# EAGLE design POWER-DCDC (EAGLE 9.4.0)
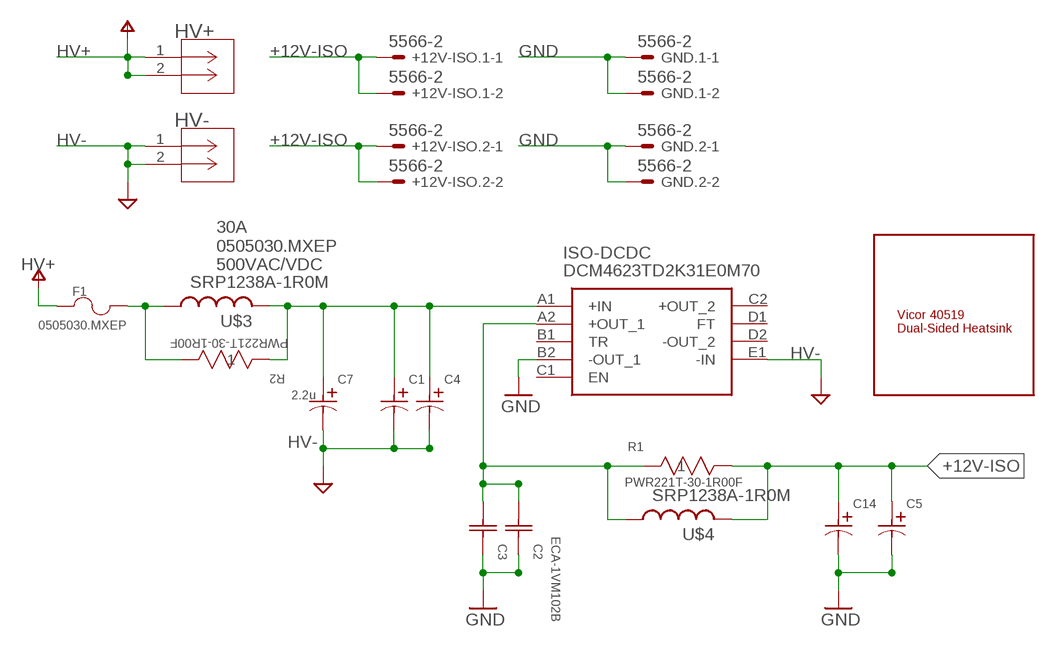
[diagram p0: schematic, sheet 1]

## Parts
+12V-ISO.1  5566-2  [5566-2]
+12V-ISO.2  5566-2  [5566-2]
C1  ECA-2WHG2R2  [PCAP_10X125]
C2  ECA-1VM102B  [CAP_PAN_12.5X20]
C3  ECA-1VM102B  [CAP_PAN_12.5X20]
C4  ECA-2WHG2R2  [PCAP_10X125]
C5  ECA-2WHG2R2  [PCAP_10X125]
C7  2.2u  ECA-2WHG2R2  [PCAP_10X125]
C14  ECA-2WHG2R2  [PCAP_10X125]
F1  0505030.MXEP  [0505030.MXEP]
GND.1  5566-2  [5566-2]
GND.2  5566-2  [5566-2]
HEATSINK  DCMHEATSINK  [DCMHEATSINK]
HV+  2P_1-770166-0  [CON2_1X2_P163_VMNL-1MTG]
HV-  2P_1-770166-0  [CON2_1X2_P163_VMNL-1MTG]
ISO-DCDC  DCM4623TD2K31E0M70  [DCM4623TD2N17C8T70]
R1  PWR221T-30-1R00F  [BO_PWR221T]
R2  PWR221T-30-1R00F  [BO_PWR221T]
U$3  SRP1238A-1R0M  [SRP1238A-R22M]
U$4  SRP1238A-1R0M  [SRP1238A-R22M]

## Nets
+12V-ISO: +12V-ISO.1.1 +12V-ISO.1.2 +12V-ISO.2.1 +12V-ISO.2.2 C5.1 C14.1 R1.2 U$4.2
+12V-OUT: C2.1 C3.1 ISO-DCDC.A2(+OUT_1) R1.1 U$4.1
GND: C2.2 C3.2 C5.2 C14.2 GND.1.1 GND.1.2 GND.2.1 GND.2.2 ISO-DCDC.B2(-OUT_1)
HV+: F1.1 HV+.1 HV+.2 ; supply symbol labelled V+
HV+_POSTFUSE: F1.2 R2.2 U$3.1
HV-: C1.2 C4.2 C7.2 HV-.1 HV-.2 ISO-DCDC.E1(-IN) ; supply symbol labelled AGND
N$1: C1.1 C4.1 C7.1 ISO-DCDC.A1(+IN) R2.1 U$3.2
Unconnected: ISO-DCDC.B1(TR) ISO-DCDC.C1(EN) ISO-DCDC.C2(+OUT_2) ISO-DCDC.D1(FT) ISO-DCDC.D2(-OUT_2)

## Notes on the sheet
- 30A
  0505030.MXEP
  500VAC/VDC

## Library data of the parts
+12V-ISO.1 +12V-ISO.2 GND.1 GND.2 = con-molex:5566-2: Mini FIT connector 2 pol Source: http://www.molex.com; MF: MOLEX; OC_FARNELL: 1822072; OC_NEWARK: unknown
C1 C4 C5 C7 C14 = IowaFormula:ECA-2WHG2R2; MANUFACTURER_PART_NUMBER: ECA2WHG2R2; VENDOR: Panasonic
C2 C3 = IowaFormula:ECA-1VM102B; MANUFACTURER_PART_NUMBER: ECA1VM102B; VENDOR: Panasonic
F1 = IowaFormula:0505030.MXEP
HEATSINK = IowaFormula:DCMHEATSINK
HV+ HV- = con-MATE-N-LOK:2P_1-770166-0; MANUFACTURER_PART_NUMBER: 17701660; VENDOR: TE Connectivity
ISO-DCDC = DCM4623:DCM4623TD2K31E0M70: Isolated DC/DC Converters 500W 270Vin 28Vout 4623 Package Source: Datasheet <https://componentsearchengine.com/Datasheets/1/DCM4623TD2K31E0M70.pdf>; DESCRIPTION: Isolated DC/DC Converters 500W 270Vin 28Vout 4623 Package; HEIGHT: 5mm; MANUFACTURER_NAME: VICOR; MANUFACTURER_PART_NUMBER: DCM4623TD2K31E0M70; MOUSER_PART_NUMBER: 492-DCM4623D2K31E0M7; MOUSER_PRICE-STOCK: https://www.mouser.com/Search/Refine.aspx?Keyword=492-DCM4623D2K31E0M7
R1 R2 = IowaFormula:PWR221T-30-1R00F; MANUFACTURER_PART_NUMBER: PWR221T301R00F; VENDOR: Bourns Electronics
U$3 U$4 = IowaFormula:SRP1238A-1R0M

## Board
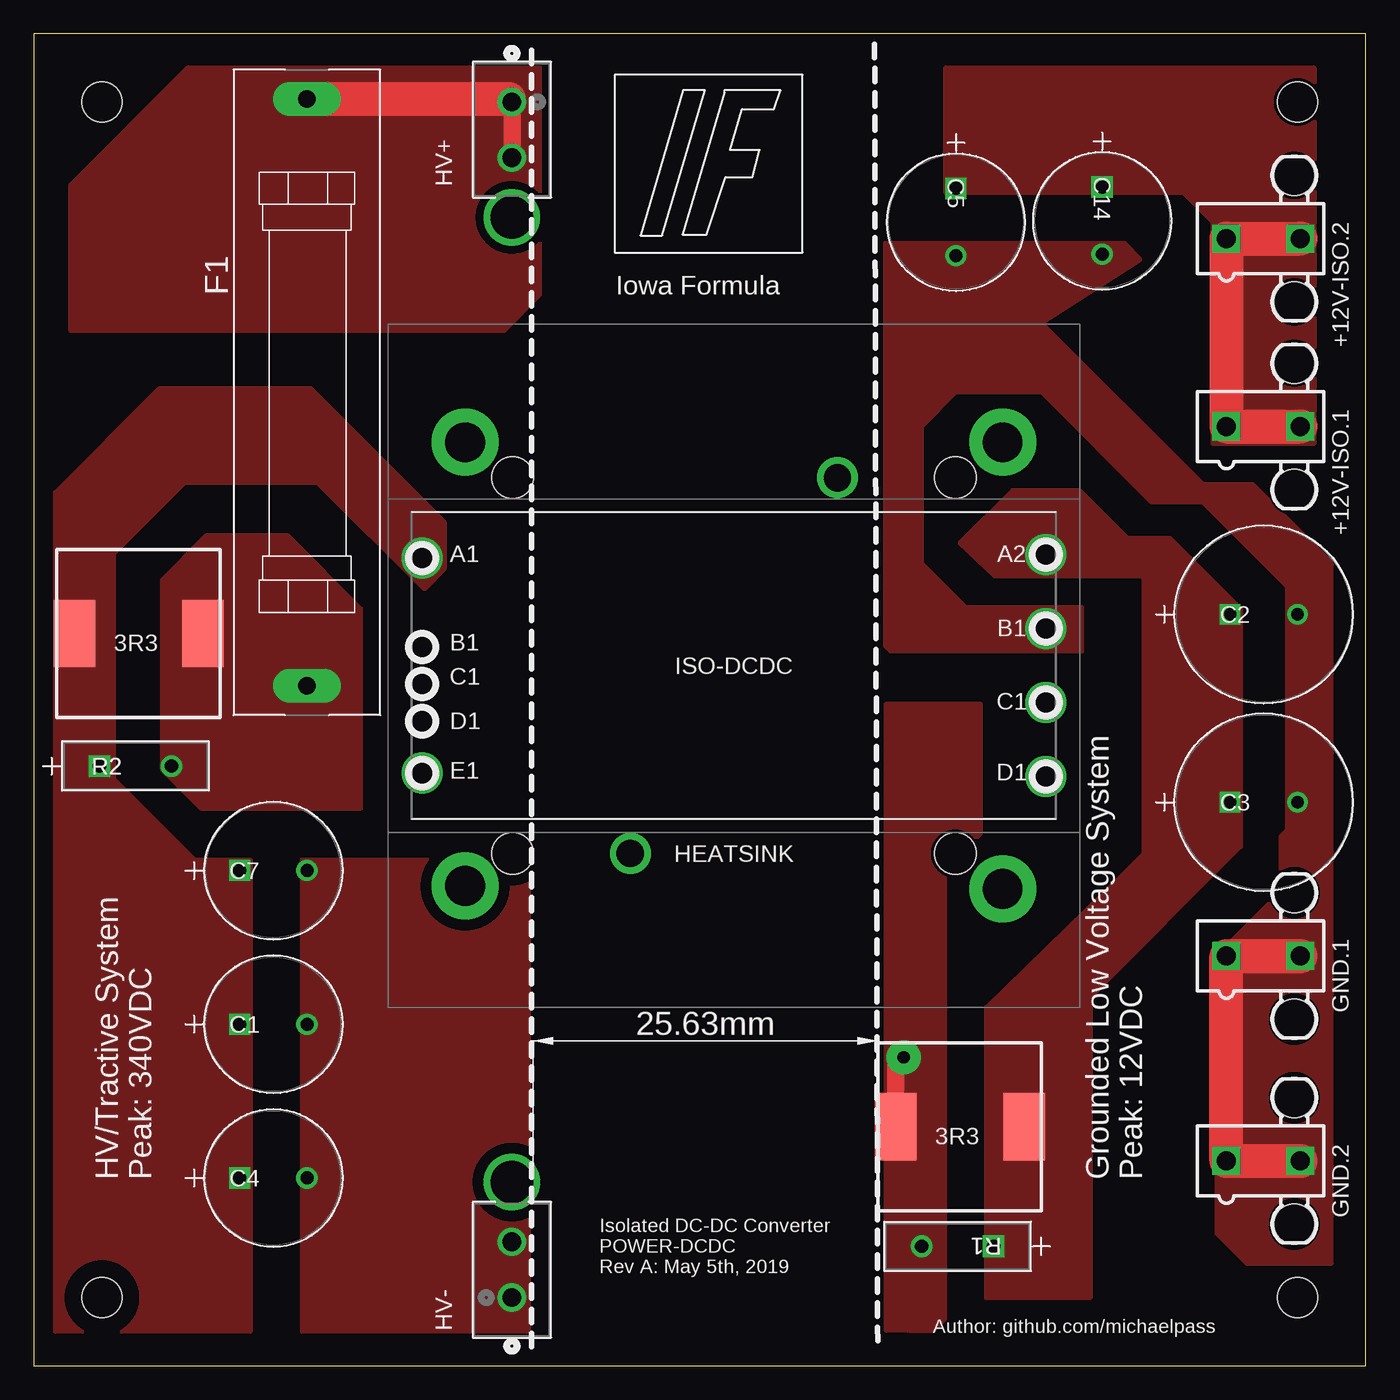
[diagram p1: board, top side]
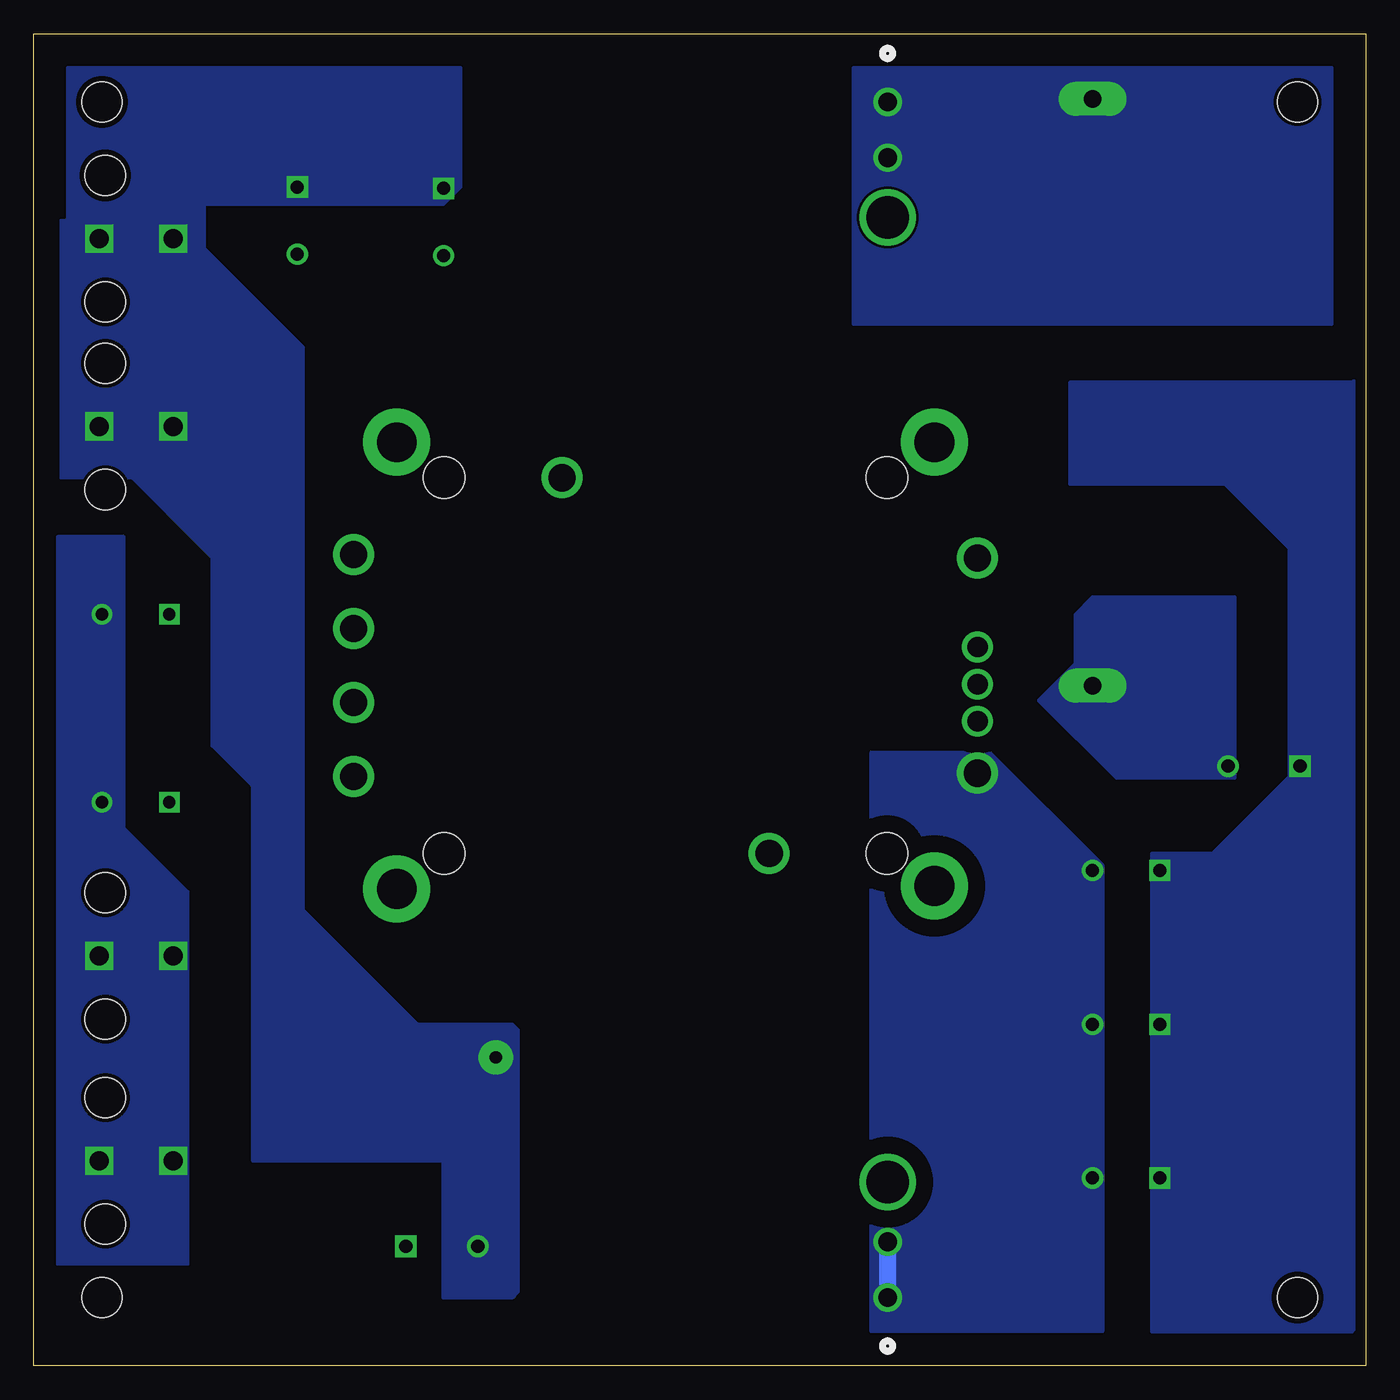
[diagram p2: board, bottom side, seen from below]

Size 99.06 x 99.06 mm. Coordinates in mm from the lower left corner, seen from the top.
Outline: 0,0 99.06,0 99.06,99.06 0,99.06 0,0
Copper layers (1*16): Top 0.035mm / dielectric 1.5mm / Bottom 0.035mm
Design rules "default *": minimum track width 8mil, minimum drill 20mil, track to track 8mil, track to pad 8mil, pad to pad 8mil, via to via 8mil, smd to smd 8mil, copper to edge 10mil, drill to drill 8mil, minimum pad ring 12mil, minimum via ring 10mil, stop-mask expansion 4mil, vias tented up to drill 25mil, thermal gap 10mil
Holes 3 mm at 93.98,93.98 93.98,5.08 5.08,5.08 5.08,93.98

### Footprints (pad centres in the part's own frame; a part is rotated, then mirrored left to right if it is on the bottom)
5566-2 = drill 1.4 square: 1 0,-2.75; 2 0,2.75 | hole 3: 4.7,2.29; -4.7,2.29
PCAP_10X125 = drill 0.965 pad 1.524 square: 1 -5.004,0 | drill 0.965 pad 1.524: 2 0,0
CAP_PAN_12.5X20 = drill 0.914 pad 1.422 square: 1 -5.004,0 | drill 0.914 pad 1.422: 2 0,0
0505030.MXEP = drill 1.321 pad 2.54 long: 1 -21.819,0; 2 21.819,0
DCMHEATSINK = drill 2.946 pad 4.978: 1 -19.99,-16.383; 2 19.99,16.612; 3 -19.99,16.612; 5 19.99,-16.612 | drill 2.032 pad 2.794: 4 7.696,13.97; 6 -7.696,-13.97 | hole 3.1: -16.459,-13.97; 16.459,-13.97; 16.459,13.97; -16.459,13.97
CON2_1X2_P163_VMNL-1MTG = drill 1.397 pad 1.905: 1 0,0; 2 4.14,0 | drill 3.175 pad 3.175: 3 8.585,0
DCM4623TD2N17C8T70 = drill 2.03 pad 3.045: A1 -23.19,8; A2 23.19,8.25; B2 23.19,2.75; C2 23.19,-2.75; D2 23.19,-8.25; E1 -23.19,-8 | drill 1.52 pad 2.28: B1 -23.19,1.38; C1 -23.19,-1.38; D1 -23.19,-4.14
BO_PWR221T = drill 0.991 pad 1.499 square: 1 -5.334,0 | drill 0.991 pad 1.499: 2 0,0
SRP1238A-R22M = smd 3.099 x 5.004: 1 0,0; 2 9.55,0

### Placement (x,y rotation side)
+12V-ISO.1  91.44,69.85 270 top
+12V-ISO.2  91.44,83.82 270 top
C1  20.32,25.4 0 top
C2  93.98,55.88 0 top
C3  93.98,41.91 0 top
C4  20.32,13.97 0 top
C5  68.58,82.55 270 top
C7  20.32,36.83 0 top
C14  79.45,82.65 270 top
F1  20.32,72.39 270 top
GND.1  91.44,30.48 270 top
GND.2  91.44,15.24 270 top
HEATSINK  52.07,52.07 0 top
HV+  35.56,93.98 270 top
HV-  35.56,5.08 90 top
ISO-DCDC  52.07,52.07 0 top
R1  66.04,8.89 180 top
R2  10.24,44.6 0 top
U$3  12.6,54.46 180 top
U$4  73.66,17.78 180 top

### Tracks (layer width: path | path; a pad name or v marks a point on that pad's centre or on a via)
+12V-ISO  (via drill 0.9 pad 2.54)
  Top 1.27: U$4.2 64.11,22.35 v64.69,22.94
  Top 2.54: +12V-ISO.1.2 +12V-ISO.1.1 +12V-ISO.2.1 +12V-ISO.2.2
  pour Top (no thermals): 87.63,68.58 95.25,68.58 95.25,96.52 67.77,96.52 67.77,87.25 85.47,87.25 87.63,85.09
  pour Bottom (isolate 0.305, no thermals): 63.07,24.97 63.07,5.51 63.5,5.08 68.58,5.08 68.58,15.24 82.73,15.24 82.73,43.1 85.75,46.13 85.75,60.1 91.69,66.04 96.98,66.04 96.98,85.17 88.47,85.17 79.04,75.74 79.04,33.91 70.54,25.4 63.5,25.4
  pour Top (no thermals): 67.72,36.2 67.72,3.56 66.78,2.62 63.42,2.69 63.42,49.17 70.36,49.17 70.36,39.62 68.76,38.02 68.76,37.24
  pour Bottom (isolate 0.406, no thermals): 67.31,87.63 68.58,86.36 86.36,86.36 86.36,81.28 96.52,81.28 96.52,96.52 67.31,96.52
+12V-OUT
  pour Top (isolate 0.305, no thermals): 71.47,58.7 68.84,61.17 72.8,65.13 77.75,65.13 81.28,61.59 84.48,61.59 89.76,56.31 89.76,38.61 78.56,27.41 78.56,5.03 70.84,5.03 70.84,26.67 81.28,36.83 82.55,38.1 82.55,58.7
GND
  Top 2.54: GND.1.2 GND.1.1 GND.2.1 GND.2.2
  pour Bottom (isolate 0.305, no thermals): 97.28,61.62 97.28,7.62 87.6,7.62 87.6,35.2 92.35,39.95 92.35,61.62
  pour Top (isolate 0.406, no thermals): 77.98,56.39 69.34,56.39 66.04,59.69 66.04,69.85 68.58,72.39 74.93,72.39 83.09,64.23 86.9,64.23 93.19,57.94 93.19,38.89 93.98,38.1 95.25,38.1 96.52,39.37 96.52,59.69 90.68,65.53 87,65.53 74.98,77.55 82.32,82.27 81.13,83.46 63.3,83.46 63.3,53.54 63.7,53.14 77.98,53.14
  pour Top (isolate 0.406, no thermals): 92.71,39.37 92.71,35.26 87.93,30.48 87.93,9.86 90.17,7.62 96.52,7.62 96.52,40.64 93.98,40.64
HV+
  Top 1.27: HV+.2 HV+.1 35.33,94.21
  Top 2.54: F1.1 35.33,94.21
  pour Top (isolate 0.61, no thermals): 37.67,96.52 11.43,96.52 2.72,87.81 2.72,76.99 35,76.99 37.67,79.65
  pour Bottom (no thermals): 2.54,77.47 38.1,77.47 38.1,96.52 2.54,96.52
HV+_POSTFUSE
  pour Top (isolate 1.27, no thermals): 9.53,44.35 12.42,41.45 24.36,41.45 24.36,56.29 18.92,61.72 12.8,61.72 9.53,58.45
  pour Bottom (isolate 0.406, no thermals): 9.75,57.15 9.75,43.71 18.57,43.71 24.33,49.48 21.59,52.22 21.59,55.88 20.32,57.15
HV-
  Bottom 1.27: HV-.2 HV-.1
  pour Bottom (isolate 1.27, no thermals): 36.75,45.62 27.99,45.62 19.61,37.24 19.61,2.57 36.75,2.57
  pour Top (isolate 0.813, no thermals): 19.91,37.64 36.83,37.64 36.83,2.54 19.91,2.54
N$1
  pour Top (isolate 1.27, no thermals): 16.13,37.64 16.13,2.54 1.6,2.54 1.6,64.95 9.35,72.69 20.6,72.69 30.56,62.74 30.56,59.23 29.06,57.73 21.13,65.66 11.23,65.66 5.94,60.38 5.94,43.66 11.96,37.64
  pour Bottom (isolate 0.406, no thermals): 15.93,2.54 15.93,38.1 11.43,38.1 5.69,43.84 5.69,60.78 10.49,65.58 22.02,65.58 22.02,73.1 21.97,73.15 0.99,73.15 0.89,73.25 0.89,2.67 1.02,2.54

### Text on the board
tPlace: HV/Tractive System / Peak: 340VDC | Grounded Low Voltage System / Peak: 12VDC
tNames: Iowa Formula | Isolated DC-DC Converter / POWER-DCDC / Rev A: May 5th, 2019 | Author: github.com/michaelpass